# EAGLE schematic entrance_wall_light (EAGLE 9.6.2)
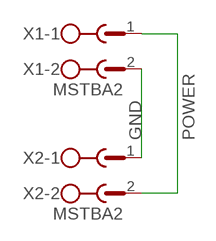
[diagram p0: schematic, sheet 1]

## Parts
X1  MSTBA2  [MSTBA2]
X2  MSTBA2  [MSTBA2]

## Nets
GND: X1.2 X2.1
POWER: X1.1 X2.2

## Library data of the parts
X1 X2 = con-phoenix-508:MSTBA2: PHOENIX; MF: FARNELL; MPN: 1757242; OC_FARNELL: 3705171; OC_NEWARK: 71C4161